# Altium schematic sheet mcu.SchDoc
size A4
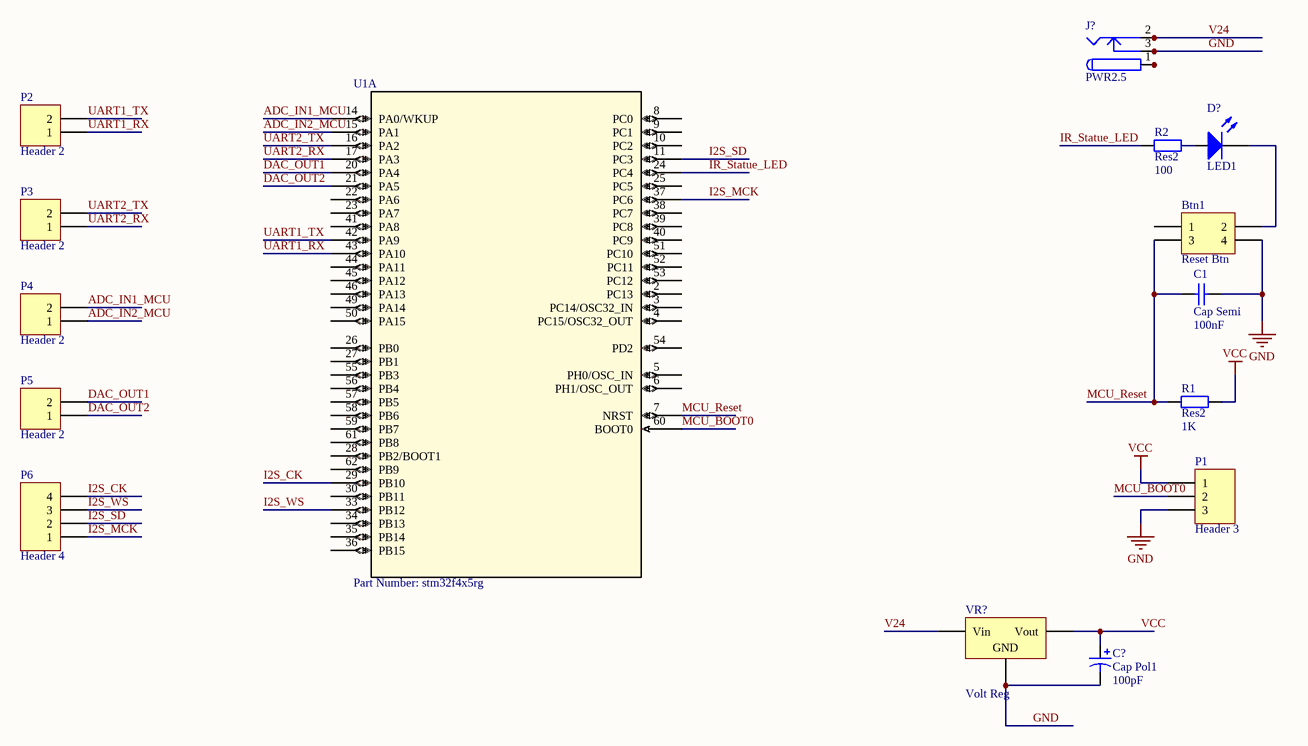
[diagram p0: mcu.SchDoc]

## Parts
Btn1  Reset Btn  [DC_Jack]
C1  Cap Semi  value 100nF  [C1210]
C?  Cap Pol1  value 100pF  [RB5-10.5]
D?  LED1  [LED-1]
J?  PWR2.5  [PCBComponent_1]
P1  Header 3  [HDR1X3]
P2  Header 2  [HDR1X2]
P3  Header 2  [HDR1X2]
P4  Header 2  [HDR1X2]
P5  Header 2  [HDR1X2]
P6  Header 4  [HDR1X4]
R1  Res2  value 1K  [AXIAL-0.4]
R2  Res2  value 100  [AXIAL-0.4]
U1  Part Number: stm32f4x5rg  [LQFP64-10x10mm]  (part A of 2)
VR?  Volt Reg  [TO-220-AB]

## Nets
GND: Btn1.4 C1.2 C?.2 J?.3 J?.3A J?.3B P1.3 VR?.2(GND)
VCC: C?.1 P1.1 R1.2 VR?.3(Vout)
ADC_IN1_MCU: P4.2 U1.14(PA0/WKUP)
ADC_IN2_MCU: P4.1 U1.15(PA1)
DAC_OUT1: P5.2 U1.20(PA4)
DAC_OUT2: P5.1 U1.21(PA5)
I2S_CK: P6.4 U1.29(PB10)
I2S_MCK: P6.1 U1.37(PC6)
I2S_SD: P6.2 U1.11(PC3)
I2S_WS: P6.3 U1.33(PB12)
IR_Statue_LED: R2.1 U1.24(PC4)
MCU_BOOT0: P1.2 U1.60(BOOT0)
MCU_Reset: Btn1.3 C1.1 R1.1 U1.7(NRST)
UART1_RX: P2.1 U1.43(PA10)
UART1_TX: P2.2 U1.42(PA9)
UART2_RX: P3.1 U1.17(PA3)
UART2_TX: P3.2 U1.16(PA2)
V24: J?.2 J?.2A J?.2B VR?.1(Vin)
NetBtn1_2: Btn1.2 D?.2(K)
NetD?_1: D?.1(A) R2.2
NetJ?_1: J?.1 J?.1A J?.1B

Not connected (* = marked no-connect by the designer): Btn1 1; U1 2(PC13) 3(PC14/OSC32_IN) 4(PC15/OSC32_OUT) 5(PH0/OSC_IN) 6(PH1/OSC_OUT) 8(PC0) 9(PC1) 10(PC2) 22(PA6) 23(PA7) 25(PC5) 26(PB0) 27(PB1) 28(PB2/BOOT1) 30(PB11) 34(PB13) 35(PB14) 36(PB15) 38(PC7) 39(PC8) 40(PC9) 41(PA8) 44(PA11) 45(PA12) 46(PA13) 49(PA14) 50(PA15) 51(PC10) 52(PC11) 53(PC12) 54(PD2) 55(PB3) 56(PB4) 57(PB5) 58(PB6) 59(PB7) 61(PB8) 62(PB9)

## Library data of the parts
Btn1 = Header 2X2: Header, 2-Pin, Dual row; LatestRevisionDate: 17-Jul-2002; LatestRevisionNote: Re-released for DXP Platform.; Publisher: Altium Limited
C1 = Cap Semi: Capacitor (Semiconductor SIM Model); Published: 8-Jun-2000; LatestRevisionDate: 29-May-2009; LatestRevisionNote: IPC-7351 Footprint Added.; PackageReference: C1206; Publisher: Altium Limited; PackageDescription: Chip Capacitor
C? = Cap Pol1: Polarized Capacitor (Radial); Published: 8-Jun-2000; LatestRevisionDate: 17-Jul-2002; LatestRevisionNote: Re-released for DXP Platform.; PackageReference: RB7.6-15; Publisher: Altium Limited; PackageDescription: Polarized Capacitor (Radial); 2 Leads
D? = LED1: Typical RED GaAs LED; Published: 8-Jun-2000; LatestRevisionDate: 08-Jul-2005; LatestRevisionNote: Mech Layer 1 removed.; PackageReference: LED-1; Publisher: Altium Limited; PackageDescription: LED; 2 Leads
J? = PWR2.5: Low Voltage Power Supply Connector; Published: 17-Dec-2003; DatasheetDocument: 09-May-2002; Publisher: Altium Limited; ComponentLink1Description: Manufacturer Link; ComponentLink1URL: http://domino.kycon.com/internet/Products.html
P1 = Header 3: Header, 3-Pin; LatestRevisionDate: 17-Jul-2002; LatestRevisionNote: Re-released for DXP Platform.; Publisher: Altium Limited
P2-P5 = Header 2: Header, 2-Pin; LatestRevisionDate: 17-Jul-2002; LatestRevisionNote: Re-released for DXP Platform.; Publisher: Altium Limited
P6 = Header 4: Header, 4-Pin; LatestRevisionDate: 17-Jul-2002; LatestRevisionNote: Re-released for DXP Platform.; Publisher: Altium Limited
R1 R2 = Res2: Resistor; Published: 8-Jun-2000; LatestRevisionDate: 17-Jul-2002; LatestRevisionNote: Re-released for DXP Platform.; PackageReference: AXIAL-0.4; Publisher: Altium Limited; PackageDescription: Axial Device, Thru-Hole; 2 Leads; 0.4 in Pin Spacing
U1 = STM32F4x5RG: No Description Available; Vendor: STMicroelectronics; Manufacturer_Part_Number: stm32f4x5rg; Copyright: Copyright (C) 2016 Accelerated Designs. All rights reserved; RefDes: RefDes; Type: DEV; Value: Value
VR? = Volt Reg: Voltage Regulator; Published: 24-Mar-1999; LatestRevisionDate: 29-May-2009; LatestRevisionNote: IPC-7351 Footprint Added.; PackageReference: D2PAK; Publisher: Altium Limited; PackageDescription: 3-Pin Transistor Outline Package 2.54 mm Pitch, 15.1 mm Lead Span